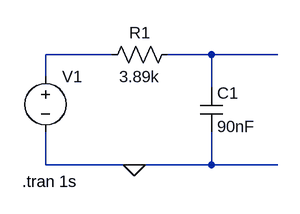
[diagram p0: schematic lab1_RC.asc]
lab1_RC.asc, the LTspice schematic file:
Version 4
SHEET 1 880 680
WIRE 128 32 32 32
WIRE 272 32 208 32
WIRE 368 32 272 32
WIRE 32 64 32 32
WIRE 272 80 272 32
WIRE 32 192 32 144
WIRE 160 192 32 192
WIRE 272 192 272 144
WIRE 272 192 160 192
WIRE 368 192 272 192
FLAG 160 192 0
SYMBOL voltage 32 48 R0
WINDOW 3 24 96 Invisible 2
WINDOW 123 0 0 Left 2
WINDOW 39 0 0 Left 2
SYMATTR InstName V1
SYMATTR Value PULSE(0 1 0 0 0 1.75ms 3.50ms 0)
SYMBOL res 224 16 R90
WINDOW 0 0 56 VBottom 2
WINDOW 3 32 56 VTop 2
SYMATTR InstName R1
SYMATTR Value 3.89k
SYMBOL cap 256 80 R0
SYMATTR InstName C1
SYMATTR Value 90nF
TEXT -2 216 Left 2 !.tran 1s

The netlist it stands for:
* lab1_RC.asc
V1 N001 0 PULSE(0 1 0 0 0 1.75ms 3.50ms 0)
R1 N002 N001 3.89k
C1 N002 0 90nF
.tran 1s
.backanno
.end